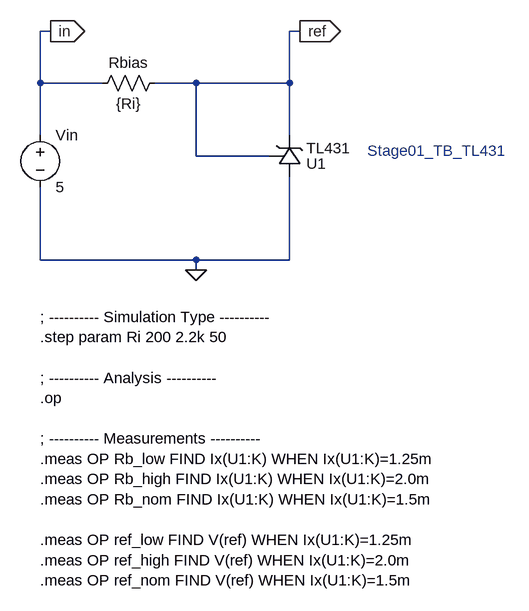
[diagram p0: schematic TL431_Ri_Sweep_5V.asc]
TL431_Ri_Sweep_5V.asc, the LTspice schematic file:
Version 4.1
SHEET 1 2864 864
WIRE -64 16 -80 16
WIRE 320 16 304 16
WIRE -80 96 -80 16
WIRE 16 96 -80 96
WIRE 160 96 96 96
WIRE 304 96 304 16
WIRE 304 96 160 96
WIRE -80 176 -80 96
WIRE 304 176 304 96
WIRE 160 208 160 96
WIRE 272 208 160 208
WIRE -80 368 -80 256
WIRE 160 368 -80 368
WIRE 304 368 304 240
WIRE 304 368 160 368
WIRE 160 384 160 368
FLAG 160 384 0
FLAG 320 16 ref
IOPIN 320 16 Out
FLAG -64 16 in
IOPIN -64 16 Out
SYMBOL voltage -80 160 R0
SYMATTR InstName Vin
SYMATTR Value 5
SYMBOL res 0 112 R270
WINDOW 0 32 56 VTop 2
WINDOW 3 0 56 VBottom 2
SYMATTR InstName Rbias
SYMATTR Value {Ri}
SYMBOL TL431 304 208 R0
SYMATTR InstName U1
TEXT -80 456 Left 2 !; ---------- Simulation Type ----------\n.step param Ri 200 2.2k 50\n \n; ---------- Analysis ----------\n.op\n  \n; ---------- Measurements ----------\n.meas OP Rb_low FIND Ix(U1:K) WHEN Ix(U1:K)=1.25m\n.meas OP Rb_high FIND Ix(U1:K) WHEN Ix(U1:K)=2.0m\n.meas OP Rb_nom FIND Ix(U1:K) WHEN Ix(U1:K)=1.5m\n \n.meas OP ref_low FIND V(ref) WHEN Ix(U1:K)=1.25m\n.meas OP ref_high FIND V(ref) WHEN Ix(U1:K)=2.0m\n.meas OP ref_nom FIND V(ref) WHEN Ix(U1:K)=1.5m
TEXT 424 200 Left 2 ;Stage01_TB_TL431

The netlist it stands for:
* TL431_Ri_Sweep_5V.asc
Vin in 0 5
Rbias in ref {Ri}
X§U1 0 ref ref TL431  ; pins A K ref
; ---------- Simulation Type ----------
.step param Ri 200 2.2k 50
; ---------- Analysis ----------
.op
; ---------- Measurements ----------
.meas OP Rb_low FIND Ix(U1:K) WHEN Ix(U1:K)=1.25m
.meas OP Rb_high FIND Ix(U1:K) WHEN Ix(U1:K)=2.0m
.meas OP Rb_nom FIND Ix(U1:K) WHEN Ix(U1:K)=1.5m
.meas OP ref_low FIND V(ref) WHEN Ix(U1:K)=1.25m
.meas OP ref_high FIND V(ref) WHEN Ix(U1:K)=2.0m
.meas OP ref_nom FIND V(ref) WHEN Ix(U1:K)=1.5m
* Stage01_TB_TL431
.lib TL431.mod
.backanno
.end